# Altium schematic sheet Connectors-and-Filters.schdoc
size A4; SheetNumber: 3; SheetTotal: 5
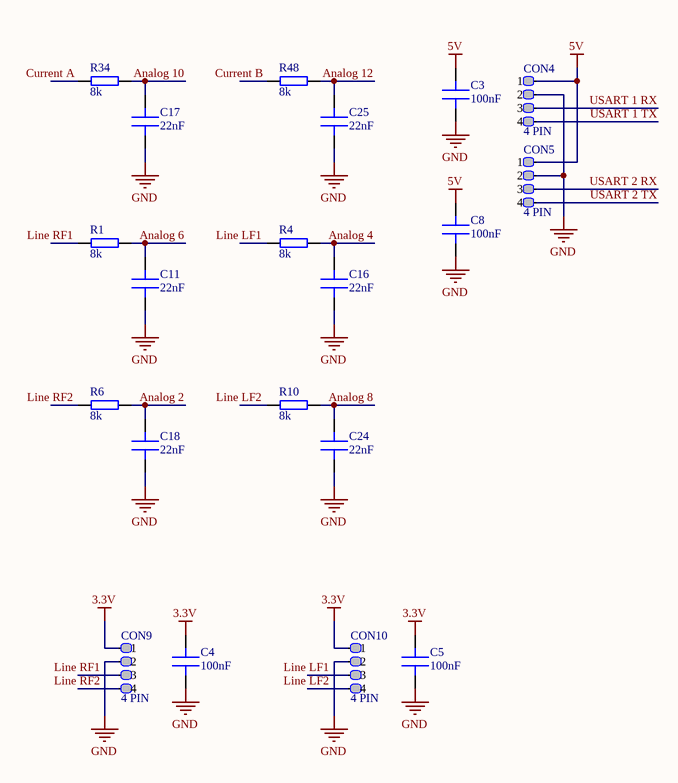
[diagram p0: Connectors-and-Filters.schdoc]

## Parts
C3  100nF  [C 0402]
C4  100nF  [C 0402]
C5  100nF  [C 0402]
C8  100nF  [C 0402]
C11  22nF  [C 0402]
C16  22nF  [C 0402]
C17  22nF  [C 0402]
C18  22nF  [C 0402]
C24  22nF  [C 0402]
C25  22nF  [C 0402]
CON4  4 PIN  [BM04B-SRSS-TB]
CON5  4 PIN  [BM04B-SRSS-TB]
CON9  4 PIN  [SM04B-SRSS-TB]
CON10  4 PIN  [SM04B-SRSS-TB]
R1  8k  [R 0402]
R4  8k  [R 0402]
R6  8k  [R 0402]
R10  8k  [R 0402]
R34  8k  [R 0402]
R48  8k  [R 0402]

## Nets
3.3V: C4.1 C5.1 CON9.1 CON10.1
5V: C3.1 C8.1 CON4.1 CON5.1
GND: C3.2 C4.2 C5.2 C8.2 C11.2 C16.2 C17.2 C18.2 C24.2 C25.2 CON4.2 CON5.2 CON9.2 CON10.2
Analog 2: C18.1 R6.1
Analog 4: C16.1 R4.1
Analog 6: C11.1 R1.1
Analog 8: C24.1 R10.1
Analog 10: C17.1 R34.1
Analog 12: C25.1 R48.1
Current A: R34.2
Current B: R48.2
Line LF1: CON10.3 R4.2
Line LF2: CON10.4 R10.2
Line RF1: CON9.3 R1.2
Line RF2: CON9.4 R6.2
USART 1 RX: CON4.3
USART 1 TX: CON4.4
USART 2 RX: CON5.3
USART 2 TX: CON5.4

## Library data of the parts
C3-C5 C8 C11 C16-C18 C24 C25 = Capacitor: MLCC Capacitor
R1 R4 R6 R10 R34 R48 = Resistor: General pourpouse resistor